# Altium schematic sheet Relay Channel.SchDoc: DMMSwitchBoard - Relay Channel
size A4; DocumentNumber: 2; Revision: 1; SheetNumber: 2; SheetTotal: 2; PageSetup: Record=PageOptions|CenterHorizontal=True|CenterVertical=True|PrintScale=0.97|XCorrection=1.00|YCorrection=1.00|PrintKind=0|BorderSize=5000000|LeftOffset=0|BottomOffset=0|Orientation=2|PaperLength=1000|PaperWidth=1000|Scale=100|PaperSource=7|PrintQuality=-3|MediaType=1|DitherType=10|PrintScaleMode=1|PaperKind=A4|PaperIndex=9
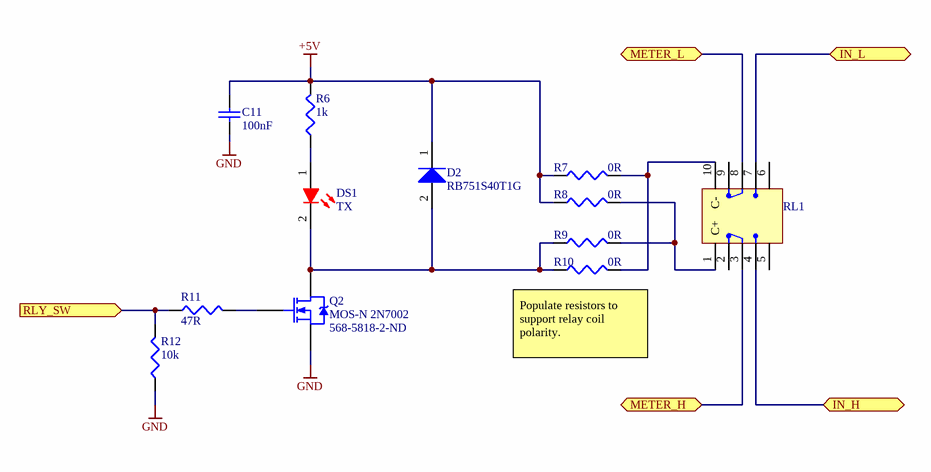
[diagram p0: Relay Channel.SchDoc]

## Parts
C11  value 100nF  [0603]  (hidden comment: C0603)
D2  RB751S40T1G  [ONSC-SOD-523-2-502-01_C_V]
DS1  TX  [TOSH-0603LED_RED_V]
Q2  MOS-N 2N7002  Supplier Part Number 1: 568-5818-2-ND  [SOT-23B_N]
R6  value 1k  [0603]  (hidden comment: Resistor)
R7  value 0R  [0603]  (hidden comment: Resistor)
R8  value 0R  [0603]  (hidden comment: Resistor)
R9  value 0R  [0603]  (hidden comment: Resistor)
R10  value 0R  [0603]  (hidden comment: Resistor)
R11  value 47R  [0603]  (hidden comment: Resistor)
R12  value 10k  [0603]  (hidden comment: Resistor)
RL1  Relay - PS-5  [PS-5 Relay]  (value not drawn)

## Ports
IN_H, IN_L, METER_H, METER_L, RLY_SW (in)

## Nets
+5V: C11.2 D2.1(K) R6.2 R7.1 R8.1
GND: C11.1 Q2.2(S) R12.1
IN_H: RL1.4 ; port IN_H
IN_L: RL1.7 ; port IN_L
METER_H: RL1.3 ; port METER_H
METER_L: RL1.8 ; port METER_L
RLY_SW: R11.1 R12.2 ; port RLY_SW
NetD2_2: D2.2(A) DS1.2(K) Q2.3(D) R9.1 R10.1
NetDS1_1: DS1.1(A) R6.1
NetQ2_1: Q2.1(G) R11.2
NetR7_2: R7.2 R10.2 RL1.10(C-)
NetR8_2: R8.2 R9.2 RL1.1(C+)

Not connected (* = marked no-connect by the designer): RL1 2 5 6 9

## Notes on the sheet
- (near R10) Populate resistors to support relay coil polarity.
- Title
- Size:
- Date:
- File:
- A4
- Number:
- Time:
- Revision:
- Sheet
- of
- Derryn Harvie

## Library data of the parts
C11 = C0603: Ceramic Chip Capacitor - Standard; Note: Footprint corresponds to dimensions for bulk cassette packaging. This case size has tightened tolerances.; Published: 17-Jul-2002; PackageReference: 0603; Publisher: Altium Limited; Code_JEITA: 0603; Code_IPC: 1608 [0603]
D2 = CMP-1055-00474-1: Schottky Barrier Diode, 2-Pin SOD-523, Pb-Free, Tape and Reel; Manufacturer: On Semiconductor; Configuration: Single; IFSM Max (A): 0.5; ComponentLink1Description: Manufacturer URL; Packing: Tape and Reel; Mounting Technology: Surface Mount; RoHS: TRUE; PackageDescription: 2-Pin SOD, Body 1.2 x 0.8 mm; PartNumber: RB751S40T1G; ComponentLink2Description: Datasheet; PackageVersion: Rev. C, 03/2007; DatasheetVersion: Rev. 4; PackageReference: SOD-523-2-502-01_C; ComponentLink1URL: http://www.onsemi.com/; ComponentLink3Description: Package Specification; ComponentLink2URL: http://www.onsemi.cn/pub_link/Collateral/RB751S40T1-D.PDF; ComponentLink3URL: http://www.onsemi.cn/pub_link/Collateral/ESD5B5.0ST1G.PDF
DS1 = CMP-0444-00001-1: LED, Red 0603 (1608) 63mCd; Manufacturer: Toshiba; PartNumber: TLSU1008A(T04); Forward Current: 25 mA; Power Dissipation: 60 mW; Packing Type: Reel; Reverse Voltage: 4 V; Mounting Technology: Surface Mount; PackageDescription: 2-Pin SMT LED, 1.6 x 0.8 mm Pitch; ComponentLink1URL: http://www.toshiba-components.com/; ComponentLink1Description: Manufacturer URL; PackageReference: 0603LED_RED; ComponentLink2URL: http://www.semicon.toshiba.co.jp/info/docget.jsp?type=datasheet&lang=en&pid=TLSU1008A(T04); ComponentLink2Description: Datasheet; DatasheetVersion: Aug-08; Storage Temperature: -40 to 100 degC
Q2 = MOS-N 2N7002: N-MOSFET 2N7002 NXP; Published: 8-Jun-2000; LatestRevisionDate: 17-Jul-2002; LatestRevisionNote: Re-released for DXP Platform.; DatasheetVersion: PD-9.814; PackageVersion: Feb-1997; PackageReference: SOT23; Publisher: Altium Limited; PackageDescription: TO, Thru-Hole, Vertical, Heatsink Mounted; 3 In-Line Leads; Pitch 2.54 mm; ComponentLink1Description: Manufacturer Link; ComponentLink1URL: http://www.irf.com/; Supplier 1: Digi-Key
RL1 = Relay - PS-5: Relay Small Signal